# EAGLE design chip (EAGLE 9.5.0)
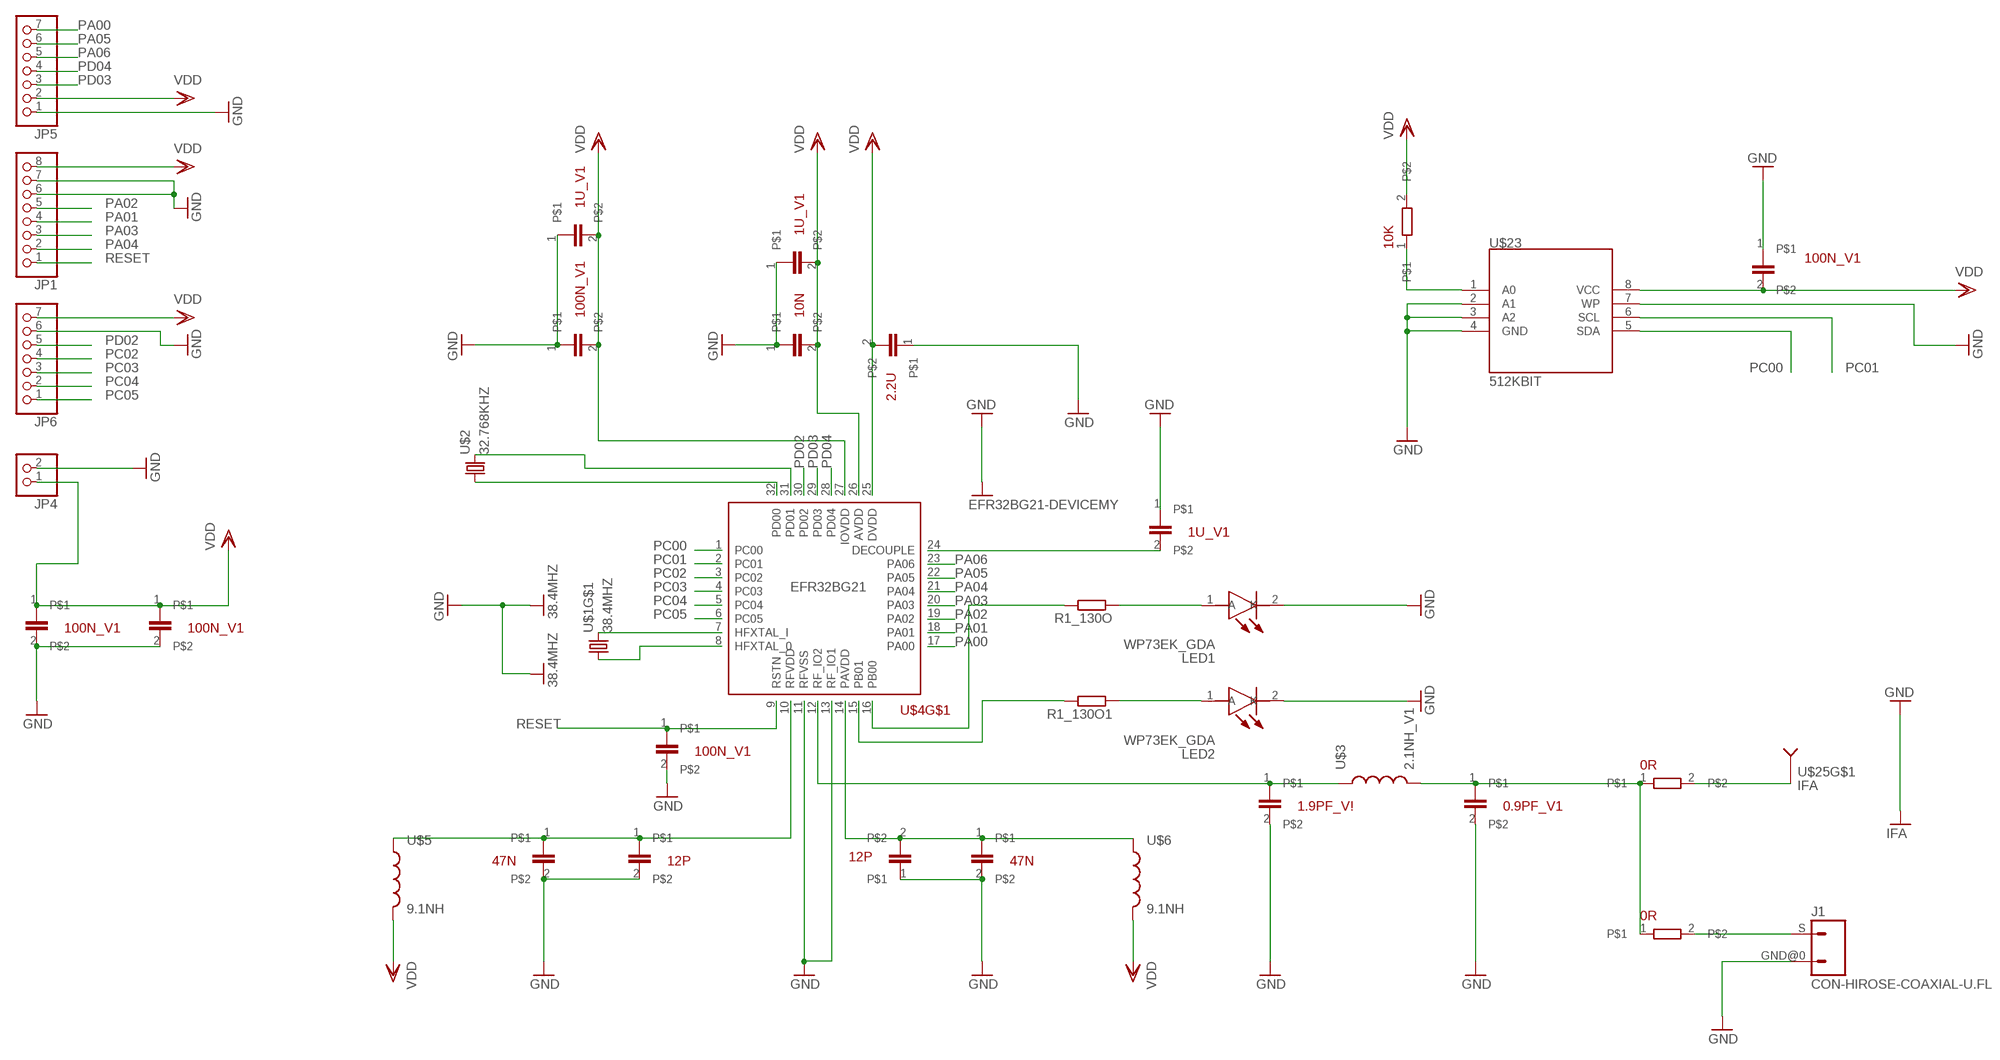
[diagram p0: schematic, sheet 1]

## Parts
J1  CON-HIROSE-COAXIAL-U.FL  [CON-U.FL]
JP1  PINHD-1X8  [1X08]
JP4  PINHD-1X2  [1X02]
JP5  PINHD-1X7  [1X07]
JP6  PINHD-1X7  [1X07]
LED1  WP73EK_GDA  [WP73EKGDA]
LED2  WP73EK_GDA  [WP73EKGDA]
R1_130O  R-EU_0204/7  [0204/7]
R1_130O1  R-EU_0204/7  [0204/7]
U$1  38.4MHZ  [OSCCC200X160X40N]
U$2  32.768KHZ  [RESC3213X90N]
U$3  2.1NH_V1  [INDC0402X30N]
U$4  EFR32BG21-DEVICEMY  [QFN40P400X400X90-33T270N]
U$5  9.1NH  [INDC0603X40N]
U$6  9.1NH  [INDC0603X40N]
U$7  100N_V1  [CAPC2012X78N]
U$8  100N_V1  [CAPC2012X78N]
U$9  100N_V1  [CAPC2012X78N]
U$10  100N_V1  [CAPC2012X78N]
U$11  0.9PF_V1  [CAPC1005X50N]
U$12  1.9PF_V!  [CAPC1005X50N]
U$13  47N  [CAPC2012X78N]
U$14  47N  [CAPC2012X78N]
U$15  12P  [CAPC1005X50N]
U$16  12P  [CAPC1005X50N]
U$17  2.2U  [CAPC2012X125N]
U$18  1U_V1  [CAPC2012X125N]
U$19  1U_V1  [CAPC2012X125N]
U$20  1U_V1  [CAPC2012X125N]
U$21  10N  [CAPC2012X78N]
U$22  100N_V1  [CAPC2012X78N]
U$23  512KBIT  [SOIC127P599X175-8N]
U$24  10K  [RESC3213X90N]
U$25  IFA  [IFA]
U$26  0R  [RESC3213X90N]
U$27  0R  [RESC3213X90N]

## Nets
GND: J1.GND@0 JP1.6 JP1.7 JP4.2 JP5.1 JP6.6 LED1.2(K) LED2.2(K) U$1.2(GND) U$1.4(GND) U$4.11(RFVSS) U$4.13(RF_IO1) U$4.33(GND) U$7.2 U$8.1 U$9.1 U$10.2 U$11.2 U$12.2 U$13.2 U$14.2 U$15.2 U$16.1 U$17.1 U$18.1 U$19.1 U$20.1 U$21.1 U$22.2 U$23.2(A1) U$23.3(A2) U$23.4(GND) U$23.7(WP) U$25.P$2
N$1: U$1.3 U$4.7(HFXTAL_I)
N$2: U$1.1 U$4.8(HFXTAL_0)
N$3: LED1.1(A) R1_130O.1
N$4: U$4.14(PAVDD) U$6.1 U$14.1 U$16.2
N$5: U$4.10(RFVDD) U$5.1 U$13.1 U$15.1
N$6: U$3.1 U$4.12(RF_IO2) U$12.1
N$7: U$3.2 U$11.1 U$26.1 U$27.1
N$8: J1.S U$27.2
N$9: U$25.P$1 U$26.2
N$10: U$4.24(DECOUPLE) U$19.2
N$11: U$2.2 U$4.31(PD01)
N$12: U$2.1 U$4.32(PD00)
N$14: LED2.1(A) R1_130O1.1
N$15: R1_130O.2 U$4.16(PB00)
N$16: R1_130O1.2 U$4.15(PB01)
N$17: U$23.1(A0) U$24.1
PA00: JP5.7 U$4.17(PA00)
PA01: JP1.4 U$4.18(PA01)
PA02: JP1.5 U$4.19(PA02)
PA03: JP1.3 U$4.20(PA03)
PA04: JP1.2 U$4.21(PA04)
PA05: JP5.6 U$4.22(PA05)
PA06: JP5.5 U$4.23(PA06)
PC00: U$4.1(PC00) U$23.5(SDA)
PC01: U$4.2(PC01) U$23.6(SCL)
PC02: JP6.4 U$4.3(PC02)
PC03: JP6.3 U$4.4(PC03)
PC04: JP6.2 U$4.5(PC04)
PC05: JP6.1 U$4.6(PC05)
PD02: JP6.5 U$4.30(PD02)
PD03: JP5.3 U$4.29(PD03)
PD04: JP5.4 U$4.28(PD04)
RESET: JP1.1 U$4.9(RSTN) U$10.1
VDD: JP1.8 JP4.1 JP5.2 JP6.7 U$4.25(DVDD) U$4.26(AVDD) U$4.27(IOVDD) U$5.2 U$6.2 U$7.1 U$8.2 U$9.2 U$17.2 U$18.2 U$20.2 U$21.2 U$22.1 U$23.8(VCC) U$24.2

## Library data of the parts
J1 = m-pad-2.1:CON-HIROSE-COAXIAL: Hirose SMT 50 ohm impedance connector W.FL ............................. 1.4mm mated height, ultra small SMT connectors .................................. DC to 3GHz U.FL .............................. 1.9mm or 2.4mm mated height, ultra small SMT connectors ................... DC to 6GHz E.FL ............................... 3.2mm mated height, ultra small SMT connectors .................................. DC to 2GHz H.FL .............................. 3.0mm mated height, ultra small SMT connectors ................................... DC to 3GHz S.FL. ............................. 6.0mm mated height, SMT connectors ................................................... DC to 2.5GHz FL ................................. 10.5mm mated height, SMT connectors .................................................. DC to 1.5GHz Please send any comments to: messi@users.sourceforge.net
JP1 = pinhead:PINHD-1X8: PIN HEADER
JP4 = pinhead:PINHD-1X2: PIN HEADER
JP5 JP6 = pinhead:PINHD-1X7: PIN HEADER
LED1 LED2 = SamacSys_Parts:WP73EK_GDA: LED Circuit Board Indicators 4.8mm RA 568nm LED INDICATOR Source: Datasheet <https://componentsearchengine.com/Datasheets/1/WP73EK_GDA.pdf>; DESCRIPTION: LED Circuit Board Indicators 4.8mm RA 568nm LED INDICATOR; HEIGHT: 6.1mm; MANUFACTURER_NAME: Kingbright; MANUFACTURER_PART_NUMBER: WP73EK/GDA; MOUSER_PART_NUMBER: 604-WP73EKGDA; MOUSER_PRICE-STOCK: https://www.mouser.com/Search/Refine.aspx?Keyword=604-WP73EKGDA
R1_130O R1_130O1 = rcl:R-EU_: RESISTOR, European symbol; SPICEPREFIX: R
U$1 = OSCCC200X160X40N:38.4MHZ: CX2016DB38400F0FSRC1 Kyocera Electronic Components https://pl.mouser.com/ProductDetail/Kyocera-Electronic-Components/CX2016DB38400F0FSRC1?qs=sGAEpiMZZMsBj6bBr9Q9abMK2mGYOCsJqa5Pug4KiYXEz1o%252Bm2z7Uw%3D%3D
U$2 = OSCCC200X160X40N:32.768KHZ
U$3 = INDC2624X183N:2.1NH: LQP02HQ2N1B02L Murata Electronics https://pl.mouser.com/ProductDetail/Murata-Electronics/LQP02HQ2N1B02L?qs=sGAEpiMZZMsg%252By3WlYCkUyZWwNSx5NjRSIvJvYgVFAI%3D
U$4 = EFR32BG21:EFR32BG21-DEVICE: EFR32BG21
U$5 U$6 = INDC2624X183N:9.1NH
U$7-U$10 U$22 = CAPC3216X115N:100N: C0805X104K4RACAUTO KEMET https://pl.mouser.com/ProductDetail/KEMET/C0805X104K4RACAUTO?qs=sGAEpiMZZMvsSlwiRhF8qtsBU8Zhqm2ROf0L0mZMWpeGjn7SAoTGXQ%3D%3D
U$11 = CAPC3216X115N:0.9PF: CBR04C908A5GAC KEMET https://pl.mouser.com/ProductDetail/KEMET/CBR04C908A5GAC?qs=sGAEpiMZZMvsSlwiRhF8qmi3ey35rNIfeNjf9LFJj1o%3D
U$12 = CAPC3216X115N:1.9PF: CBR04C199A5GAC KEMET https://pl.mouser.com/ProductDetail/KEMET/CBR04C199A5GAC?qs=sGAEpiMZZMvsSlwiRhF8qkyrPkkEgZV5GHwRI82t5Cl8LsQDrulwpg%3D%3D
U$13 U$14 = CAPC3216X115N:47N
U$15 U$16 = CAPC3216X115N:12P
U$17 = CAPC3216X115N:2.2U
U$18-U$20 = CAPC3216X115N:1U: EMF212B7105KGHT Taiyo Yuden https://pl.mouser.com/ProductDetail/Taiyo-Yuden/EMF212B7105KGHT?qs=sGAEpiMZZMvsSlwiRhF8qtsGU%2FCnaNeQp%2FNoI9PA9DTLwomzUd%2FnJQ%3D%3D
U$21 = CAPC3216X115N:10N: C0805X103J3GACTU 10 nF KEMET https://pl.mouser.com/ProductDetail/KEMET/C0805X103J3GACTU?qs=sGAEpiMZZMvsSlwiRhF8qtsBU8Zhqm2RMiIPEVgon9JfaolSOMg%252Baw%3D%3D
U$23 = SOIC127P599X175-8N:512KBIT: https://pl.farnell.com/microchip/at24c512c-sshd-t/serial-eeprom-512kbit-1mhz-soic/dp/2345591
U$24 = RESC3213X90N:10K
U$25 = ANTENY:IFA
U$26 U$27 = RESC3213X90N:0R

## Board
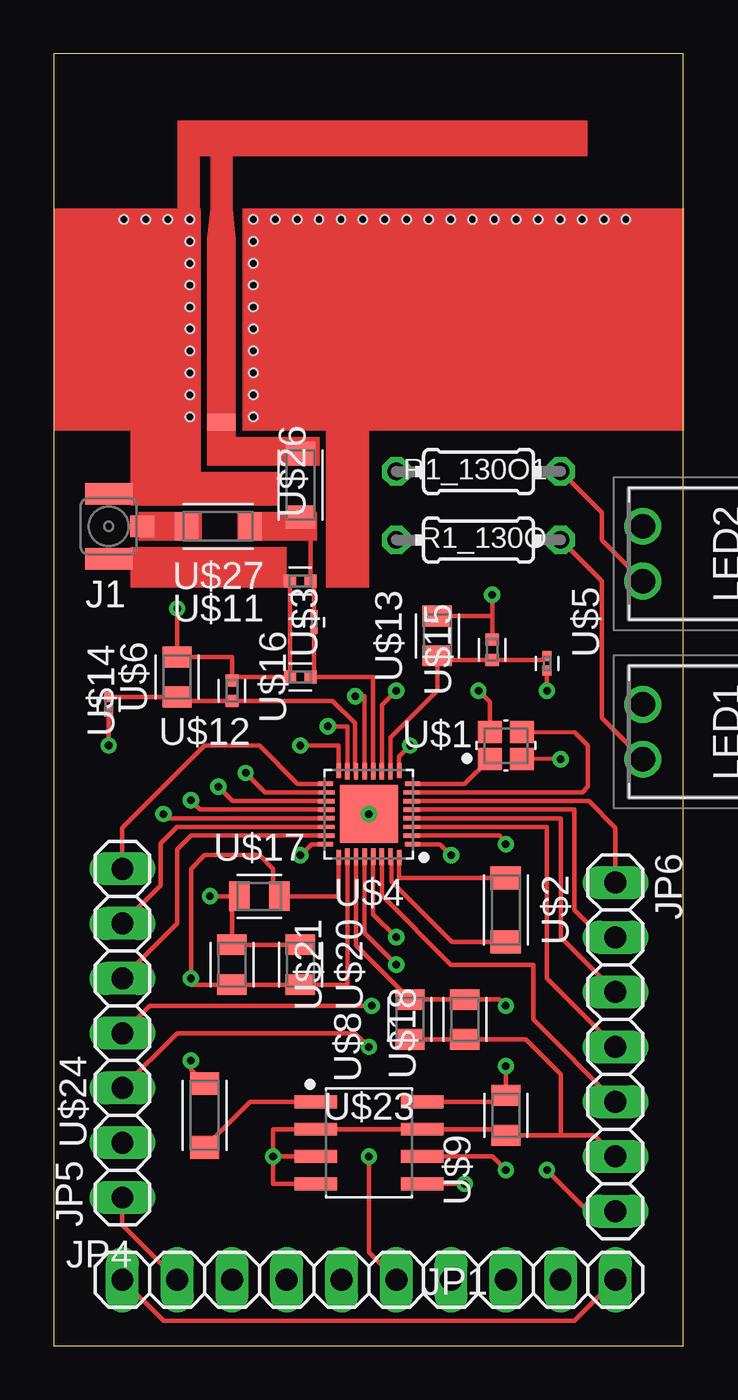
[diagram p1: board, top side]
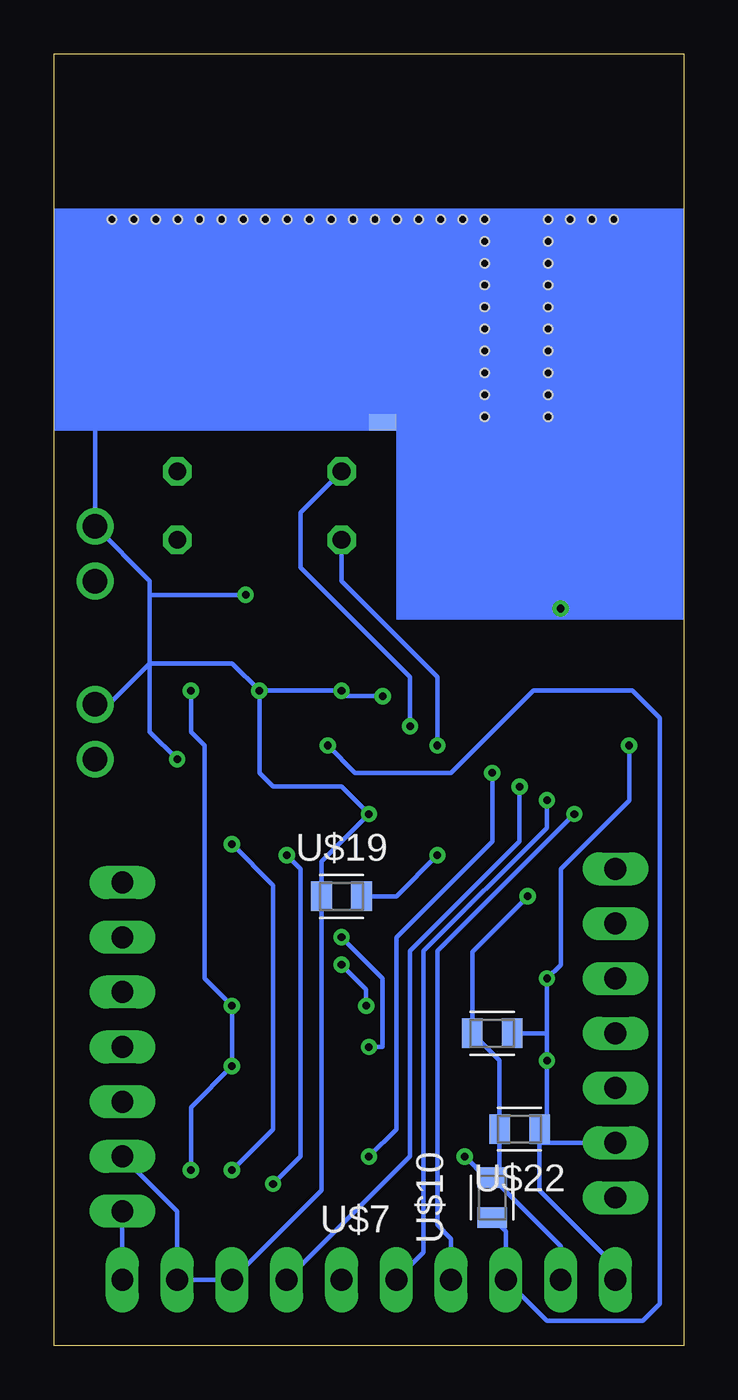
[diagram p2: board, bottom side, seen from below]

Size 29.19 x 59.87 mm. Coordinates in mm from the lower left corner, seen from the top.
Outline: 0,0 29.19,0 29.19,59.87 0,59.87 0,0
Copper layers (1*16): Top 0.035mm / dielectric 1.5mm / Bottom 0.035mm
Design rules "default": minimum track width 6mil, minimum drill 0.35mm, track to track 6mil, track to pad 6mil, pad to pad 6mil, via to via 6mil, smd to smd 6mil, copper to edge 40mil, drill to drill 6mil, minimum pad ring 10mil, minimum via ring 8mil, stop-mask expansion 4mil, vias tented up to drill 0mil, thermal gap 10mil

### Footprints (pad centres in the part's own frame; a part is rotated, then mirrored left to right if it is on the bottom)
CON-U.FL = smd 1 x 2.2: GND@0 -1.5,0; GND@1 1.5,0 | smd 1 x 1.1: S 0,-1.55
1X08 = drill 1.016 long: 1 -8.89,0; 2 -6.35,0; 3 -3.81,0; 4 -1.27,0; 5 1.27,0; 6 3.81,0; 7 6.35,0; 8 8.89,0
1X02 = drill 1.016 long: 1 -1.27,0; 2 1.27,0
1X07 = drill 1.016 long: 1 -7.62,0; 2 -5.08,0; 3 -2.54,0; 4 0,0; 5 2.54,0; 6 5.08,0; 7 7.62,0
WP73EKGDA = drill 1.139 pad 1.708: 1 0,0; 2 2.54,0
0204/7 = drill 0.813 octagon: 1 -3.81,0; 2 3.81,0
OSCCC200X160X40N = smd 1.112 x 1: 1 -0.75,-0.625; 2 0.75,-0.625; 3 0.75,0.625; 4 -0.75,0.625
RESC3213X90N = smd 1.062 x 1.412: 1 -1.475,0; 2 1.475,0
INDC0402X30N = smd 0.452 x 0.312: 1 -0.33,0; 2 0.33,0
QFN40P400X400X90-33T270N = smd 0.7 x 0.2: 1 -2.015,1.4; 8 -2.015,-1.4; 17 2.015,-1.4; 24 2.015,1.4 | smd 0.76 x 0.2: 2 -1.985,1; 3 -1.985,0.6; 4 -1.985,0.2; 5 -1.985,-0.2; 6 -1.985,-0.6; 7 -1.985,-1; 18 1.985,-1; 19 1.985,-0.6; 20 1.985,-0.2; 21 1.985,0.2; 22 1.985,0.6; 23 1.985,1 | smd 0.2 x 0.7: 9 -1.4,-2.015; 16 1.4,-2.015; 25 1.4,2.015; 32 -1.4,2.015 | smd 0.2 x 0.76: 10 -1,-1.985; 11 -0.6,-1.985; 12 -0.2,-1.985; 13 0.2,-1.985; 14 0.6,-1.985; 15 1,-1.985; 26 1,1.985; 27 0.6,1.985; 28 0.2,1.985; 29 -0.2,1.985; 30 -0.6,1.985; 31 -1,1.985 | smd 2.7 x 2.7: 33 0,0
INDC0603X40N = smd 0.462 x 0.412: 1 -0.34,0; 2 0.34,0
CAPC2012X78N = smd 0.962 x 1.362: 1 -0.925,0; 2 0.925,0
CAPC1005X50N = smd 0.562 x 0.612: 1 -0.475,0; 2 0.475,0
CAPC2012X125N = smd 0.962 x 1.362: 1 -0.925,0; 2 0.925,0
SOIC127P599X175-8N = smd 1.972 x 0.599: 1 -2.472,1.905; 2 -2.472,0.635; 3 -2.472,-0.635; 4 -2.472,-1.905; 5 2.472,-1.905; 6 2.472,-0.635; 7 2.472,0.635; 8 2.472,1.905
RESC3213X90N' = smd 1.062 x 1.336: 1 -1.475,0; 2 1.475,0
IFA = smd 1.321 x 0.762: P$1 -7.468,-12.319 | smd 1.27 x 0.762 bottom: P$2 -1.27,-12.319 | hole 0.381: -5.994,-2.921; -4.978,-2.921; -3.962,-2.921; -2.946,-2.921; -1.93,-2.921; -0.914,-2.921; 0.102,-2.921; 1.118,-2.921; 2.134,-2.921; 3.15,-2.921; 4.166,-2.921; 5.182,-2.921; 6.198,-2.921; 7.214,-2.921; 8.23,-2.921; 9.246,-2.921; 10.262,-2.921; 11.278,-2.921; -5.994,-12.065; -5.994,-9.017; -5.994,-5.969; -5.994,-3.937; -5.994,-6.985; -5.994,-8.001; -5.994,-4.953; -5.994,-10.033; -5.994,-11.049; -8.941,-12.065; -8.941,-9.017; -8.941,-5.969; -8.941,-3.937; -8.941,-6.985; -8.941,-8.001; -8.941,-4.953; -8.941,-10.033; -8.941,-11.049; -11.989,-2.921; -10.973,-2.921; -9.957,-2.921; -8.941,-2.921

### Placement (x,y rotation side)
J1  2.54,37.97 90 top
JP1  17.14,3.05 0 top
JP4  4.45,3.05 0 top
JP5  3.17,14.48 90 top
JP6  26.04,13.84 270 top
LED1  27.3,27.18 90 top
LED2  27.3,35.43 90 top
R1_130O  19.68,37.34 180 top
R1_130O1  19.68,40.51 180 top
U$1  20.95,27.81 0 top
U$2  20.95,20.19 270 top
U$3  12.06,33.53 90 top
U$4  14.61,24.64 180 top
U$5  22.86,31.62 270 top
U$6  2.54,29.72 270 top
U$7  8.89,14.48 180 bottom
U$8  16.51,15.11 90 top
U$9  20.95,10.67 90 top
U$10  8.89,6.86 90 bottom
U$11  11.43,35.43 180 top
U$12  11.43,30.99 180 top
U$13  17.78,32.89 90 top
U$14  5.71,30.99 90 top
U$15  20.32,32.26 90 top
U$16  8.26,30.35 270 top
U$17  9.53,20.83 0 top
U$18  19.05,15.11 90 top
U$19  15.88,20.83 0 bottom
U$20  11.43,17.65 270 top
U$21  8.26,17.65 270 top
U$22  7.62,10.03 180 bottom
U$23  14.61,9.4 0 top
U$24  10K  [RESC3213X90N']  6.99,10.67 90 top
U$25  15.24,55.12 0 top
U$26  0R  [RESC3213X90N']  11.43,39.88 90 top
U$27  0R  [RESC3213X90N']  7.62,37.97 180 top

### Tracks (layer width: path | path; a pad name or v marks a point on that pad's centre or on a via)
GND  (via drill 0.35)
  Top 0.2: U$4.13 14.4,30.1 v13.97,30.1 | U$4.11 15.21,29.68 v15.88,30.35 | U$1.2 23.46,27.21 v23.5,27.18 | U$1.4 20.2,29.83 v19.68,30.35 | U$13.2 20.32,33.82 | 20.32,33.82 U$15.2 | 20.32,33.82 v20.32,34.8 | 23.5,9.74 U$9.1 20.66,10.03 U$23.7 U$23.2 10.16,10.03 v10.16,8.76 | 23.5,9.74 25.05,9.74 JP6.6 | U$20.1 U$21.1 8.26,20.48 U$17.1 v7.24,20.83 | v10.16,8.76 10.16,7.49 U$23.4 | U$23.3 v10.16,8.76 | U$8.1 U$18.1 21.88,14.19 23.5,12.57 23.5,9.74 | JP4.2 3.17,5.59 JP5.1 | J1.GND@0 4.67,36.47 5.71,35.43 U$11.2 U$12.2 8.26,30.99 U$16.1 8.26,31.91 U$14.2 v5.71,34.16
  Bottom 0.2: JP6.6 23.5,6.22 JP1.7 JP1.6 16.8,7.2 U$19.1 16.8,22.44 U$4.33 15.88,25.91 19.05,25.91 19.68,26.54 v19.68,30.35 | 24.77,34.8 24.77,35.43 LED2.2 27.3,43.69 14.86,43.69 U$25.P$2 13.72,43.05 10.79,43.05 5.71,37.97 v5.71,34.16 | 24.77,34.8 24.77,31.62 | 24.77,31.62 26.67,29.72 LED1.2 | v20.32,34.8 24.77,34.8 | v19.68,30.35 20.95,31.62 24.77,31.62 | v19.68,30.35 v15.88,30.35 15.62,30.1 v13.97,30.1 | v23.5,27.18 24.77,28.45 24.77,31.62 | U$10.2 8.54,8.13 U$22.2 8.54,13.21 U$7.2 9.81,18.25 v7.24,20.83 | JP4.2 5.71,4.61 U$10.2 | v10.16,8.76 9.18,7.78 U$10.2
  other vias: 14.61,24.64
N$1
  Top 0.2: 21.7,28.33 U$1.3 24.16,28.41 24.77,27.81 24.77,25.91 24.5,25.64 U$4.7
N$2
  Top 0.2: U$1.1 19.03,26.04 U$4.8
N$3
  Top 0.2: R1_130O.1 25.4,35.43 25.4,29.08 LED1.1
N$4
  Top 0.2: U$4.14 13.96,26.67 13.96,28.85 12.93,29.88 U$16.2 5.9,29.88 U$14.1 2.56,30.06 U$6.1 2.58,30.01
N$5
  Top 0.2: U$4.10 15.61,28.18 17.78,30.35 U$13.1 17.96,31.78 U$15.1 22.58,31.78 U$5.1
N$6
  Top 0.2: U$4.12 14.8,30.99 U$12.1 12.06,31.06 U$3.1
N$7
  Top 0.2: U$3.2 12.06,35.43 U$11.1 11.9,38.4 U$26.1 11.43,37.97 U$27.1
N$8
  Top 0.2: J1.S U$27.2
N$9
  Top 0.2: U$25.P$1 7.77,41.35 U$26.2
N$10  (via drill 0.35)
  Top 0.2: U$4.24 11.94,23.24 v11.43,22.73
  Bottom 0.2: v11.43,22.73 13.34,20.83 U$19.2
N$11
  Top 0.2: U$4.31 15.65,22.61 15.65,21.52 18.46,18.72 U$2.2
N$12
  Top 0.2: U$4.32 16,21.67 U$2.1
N$14
  Top 0.2: R1_130O1.1 25.4,38.61 25.4,37.34 LED2.1
N$15  (via drill 0.35)
  Top 0.2: U$4.16 13.21,27.81 v11.43,27.81
  Bottom 0.2: v11.43,27.81 11.43,30.99 15.88,35.43 R1_130O.2
N$16  (via drill 0.35)
  Top 0.2: U$4.15 13.61,28.7 v12.7,28.7
  Bottom 0.2: R1_130O1.2 17.78,38.61 17.78,36.07 12.7,30.99 v12.7,28.7
N$17
  Top 0.2: 11.93,11.1 U$23.1 9.1,11.3 U$24.1
PA00
  Top 0.2: JP5.7 3.17,24 6.99,27.81 9.53,27.81 11.3,26.04 U$4.17
PA01  (via drill 0.35)
  Top 0.2: U$4.18 9.79,25.64 v8.89,26.54 | JP1.4 14.61,4.32 v14.61,8.76
  Bottom 0.2: JP1.4 15.88,3.68 | v14.61,8.76 13.34,10.03 13.34,18.92 8.89,23.37 v8.89,26.54
PA02  (via drill 0.35)
  Top 0.2: U$4.19 8.29,25.24 v7.62,25.91
  Bottom 0.2: JP1.5 12.7,8.76 12.7,18.29 7.62,23.37 v7.62,25.91
PA03  (via drill 0.35)
  Top 0.2: U$4.20 6.79,24.84 v6.35,25.27
  Bottom 0.2: v6.35,25.27 6.35,24 12.06,18.29 12.06,4.32 JP1.3
PA04  (via drill 0.35)
  Top 0.2: U$4.21 5.28,24.44 v5.08,24.64
  Bottom 0.2: JP1.2 10.79,4.95 11.43,5.59 11.43,18.29 v5.08,24.64
PA05
  Top 0.2: U$4.22 5.71,24.04 4.95,23.27 4.95,21.33 JP5.6
PA06
  Top 0.2: U$4.23 6.35,23.64 5.71,23 5.71,19.56 JP5.5
PC00  (via drill 0.35)
  Top 0.2: U$4.1 17.91,23.24 v18.41,22.73 | U$23.5 v19.05,7.49
  Bottom 0.2: v18.41,22.73 17.78,22.1 17.78,8.76 v19.05,7.49
PC01  (via drill 0.35)
  Top 0.2: U$4.2 20.68,23.64 v20.95,23.24 | U$23.6 20.32,8.76 v20.95,8.13
  Bottom 0.2: v20.95,23.24 19.05,21.34 19.05,10.03 v20.95,8.13
PC02
  Top 0.2: JP6.4 22.86,17.02 22.86,24.04 U$4.3
PC03
  Top 0.2: JP6.3 23.5,18.92 23.5,24.44 U$4.4
PC04
  Top 0.2: JP6.2 25.4,18.92 24.13,20.19 24.13,24.84 U$4.5
PC05
  Top 0.2: JP6.1 26.04,24 24.8,25.24 U$4.6
PD02
  Top 0.2: U$4.30 15.21,20.86 18.41,17.65 22.23,17.65 22.23,15.11 JP6.5
PD03  (via drill 0.35)
  Top 0.2: U$4.29 14.8,19.99 v15.88,18.92 | JP5.3 5.71,14.48 13.97,14.48 v14.61,13.84
  Bottom 0.2: v15.88,18.92 13.97,17.02 13.97,13.84 v14.61,13.84
PD04  (via drill 0.35)
  Top 0.2: U$4.28 14.4,19.12 v15.88,17.65 | JP5.4 4.45,15.75 v14.73,15.75
  Bottom 0.2: v14.73,15.75 14.73,16.51 v15.88,17.65
RESET  (via drill 0.35)
  Top 0.2: U$4.9 16,27.31 v16.51,27.81
  Bottom 0.2: U$10.1 8.26,5.3 JP1.1 6.35,1.14 1.91,1.14 1.12,1.93 1.12,29.08 2.39,30.35 6.99,30.35 10.79,26.54 15.24,26.54 v16.51,27.81
VDD  (via drill 0.35)
  Top 0.2: U$23.8 20.66,11.3 U$9.2 v20.95,12.95 | U$4.25 13.21,20.83 U$17.2 10.16,21.12 10.16,22.1 9.53,22.73 6.99,22.73 6.35,22.1 v6.35,17.02 6.35,16.73 U$21.2 U$20.2 13.61,16.73 U$4.26 | U$4.27 14.01,18.54 U$8.2 U$18.2 20.66,16.04 v20.95,15.75 | U$6.2 v2.54,27.81 | U$5.2 v22.86,30.35 | JP6.7 24.77,6.22 v22.86,8.13 | JP4.1 5.08,1.14 24.13,1.14 JP1.8 | U$24.2 6.35,12.78 v6.35,13.21
  Bottom 0.2: JP1.8 JP6.7 | JP4.1 3.17,3.68 6.7,7.2 6.7,9.4 | 6.7,9.4 U$22.1 6.35,10.38 v6.35,13.21 6.35,14.48 | JP5.2 6.7,9.4 | 7.96,14.77 U$7.1 6.35,14.48 | v2.54,27.81 2.54,25.27 5.71,22.1 5.71,17.65 v6.35,17.02 6.35,14.48 | v22.86,30.35 22.86,28.45 22.23,27.81 22.23,17.02 v20.95,15.75 v20.95,12.95 22.86,11.05 v22.86,8.13
(copper drawn outside any net)
  shapes: Bottom area x3, Top area x10